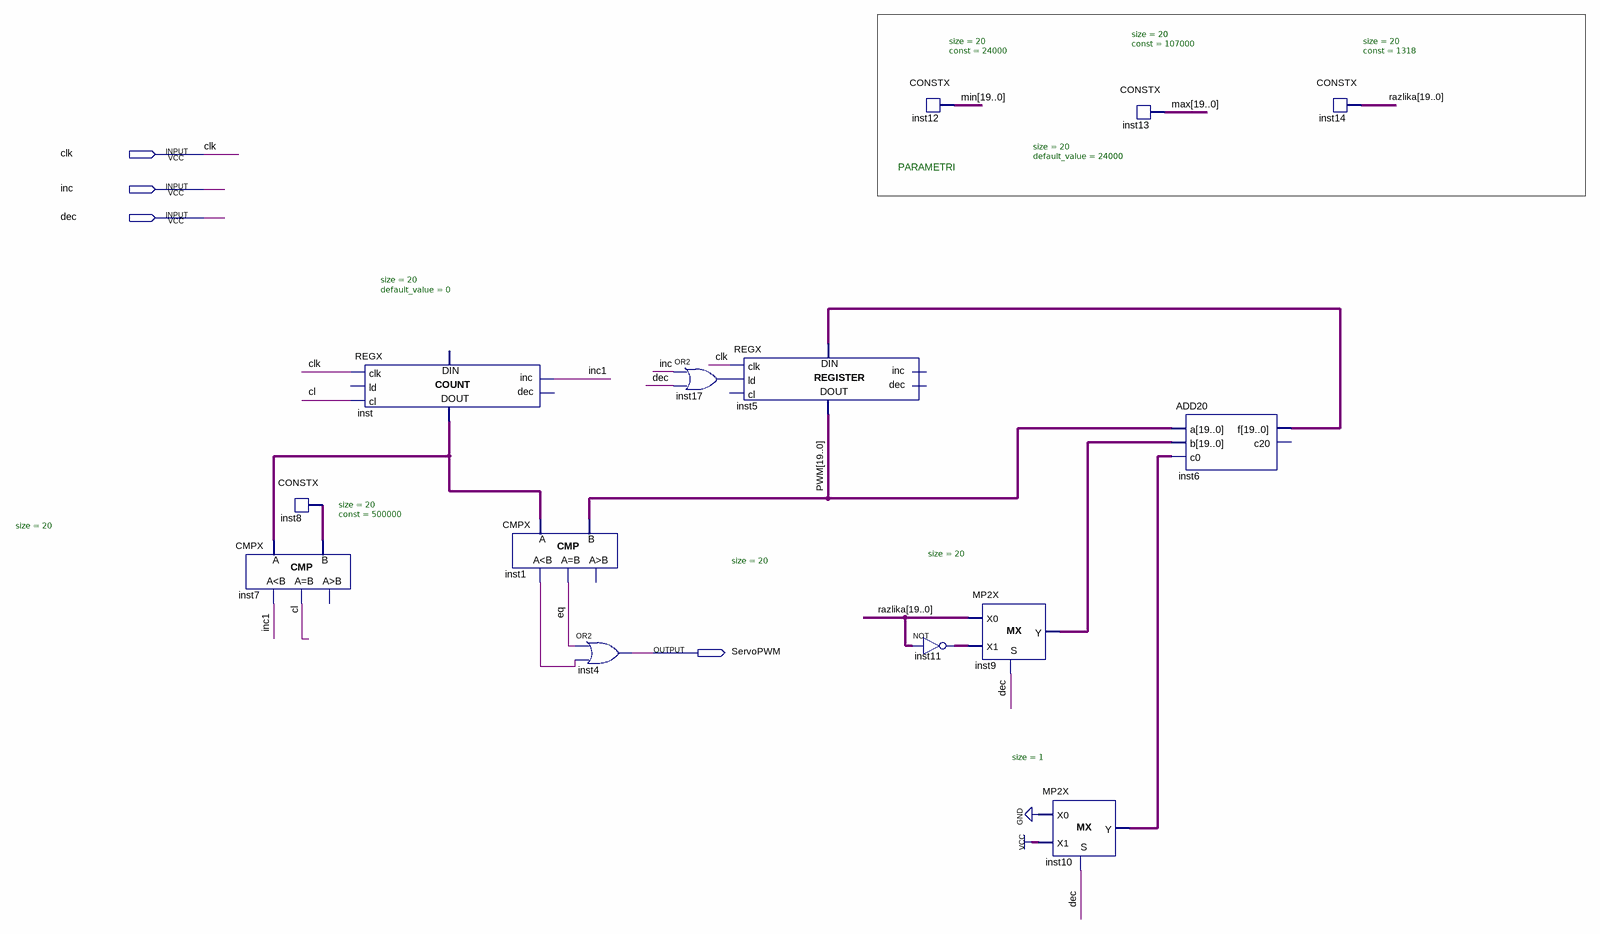
[diagram p0: schematic sheet]
// Quartus schematic servoPWM.bdf as structural Verilog: 14 symbols, 4 pins
module servoPWM (
  input  clk,
  input  inc,
  input  dec,
  output ServoPWM
);

  wire cl, eq, inc1, inst1_ls, inst10_y, inst17_out;
  wire [19:0] inst6_f, inst8_data, inst9_y, inst11_out, inst_data_out, max, min, PWM, razlika;

  CMPX #(.size(20)) inst7 (.A(inst_data_out), .B(inst8_data), .ls(inc1), .eq(cl));  // open: gr
  CONSTX #(.size(20), .\const (500000)) inst8 (.data(inst8_data));
  REGX #(.size(20), .default_value(0)) inst (
    .clk(clk), .cl(cl), .inc(inc1), .data_out(inst_data_out));  // open: ld, dec, data_in
  CMPX #(.size(20)) inst1 (.A(inst_data_out), .B(PWM), .ls(inst1_ls), .eq(eq));  // open: gr
  or inst4 (ServoPWM, eq, inst1_ls);
  or inst17 (inst17_out, inc, dec);
  REGX #(.size(20), .default_value(24000)) inst5 (
    .clk(clk), .ld(inst17_out), .data_in(inst6_f), .data_out(PWM));  // open: cl, inc, dec
  CONSTX #(.size(20), .\const (24000)) inst12 (.data(min));
  assign inst11_out = ~razlika;  // NOT inst11, 20 bits wide
  MP2X #(.size(20)) inst9 (.S(dec), .X0(razlika), .X1(inst11_out), .Y(inst9_y));
  MP2X #(.size(1)) inst10 (.S(dec), .X0(1'b0), .X1(1'b1), .Y(inst10_y));
  CONSTX #(.size(20), .\const (107000)) inst13 (.data(max));
  ADD20 inst6 (.a(PWM), .b(inst9_y), .c0(inst10_y), .f(inst6_f));  // open: c20
  CONSTX #(.size(20), .\const (1318)) inst14 (.data(razlika));

  // Notes on the sheet:
  //   PARAMETRI
endmodule
